# Altium project FMC_4Hyperram_board.PrjPcb
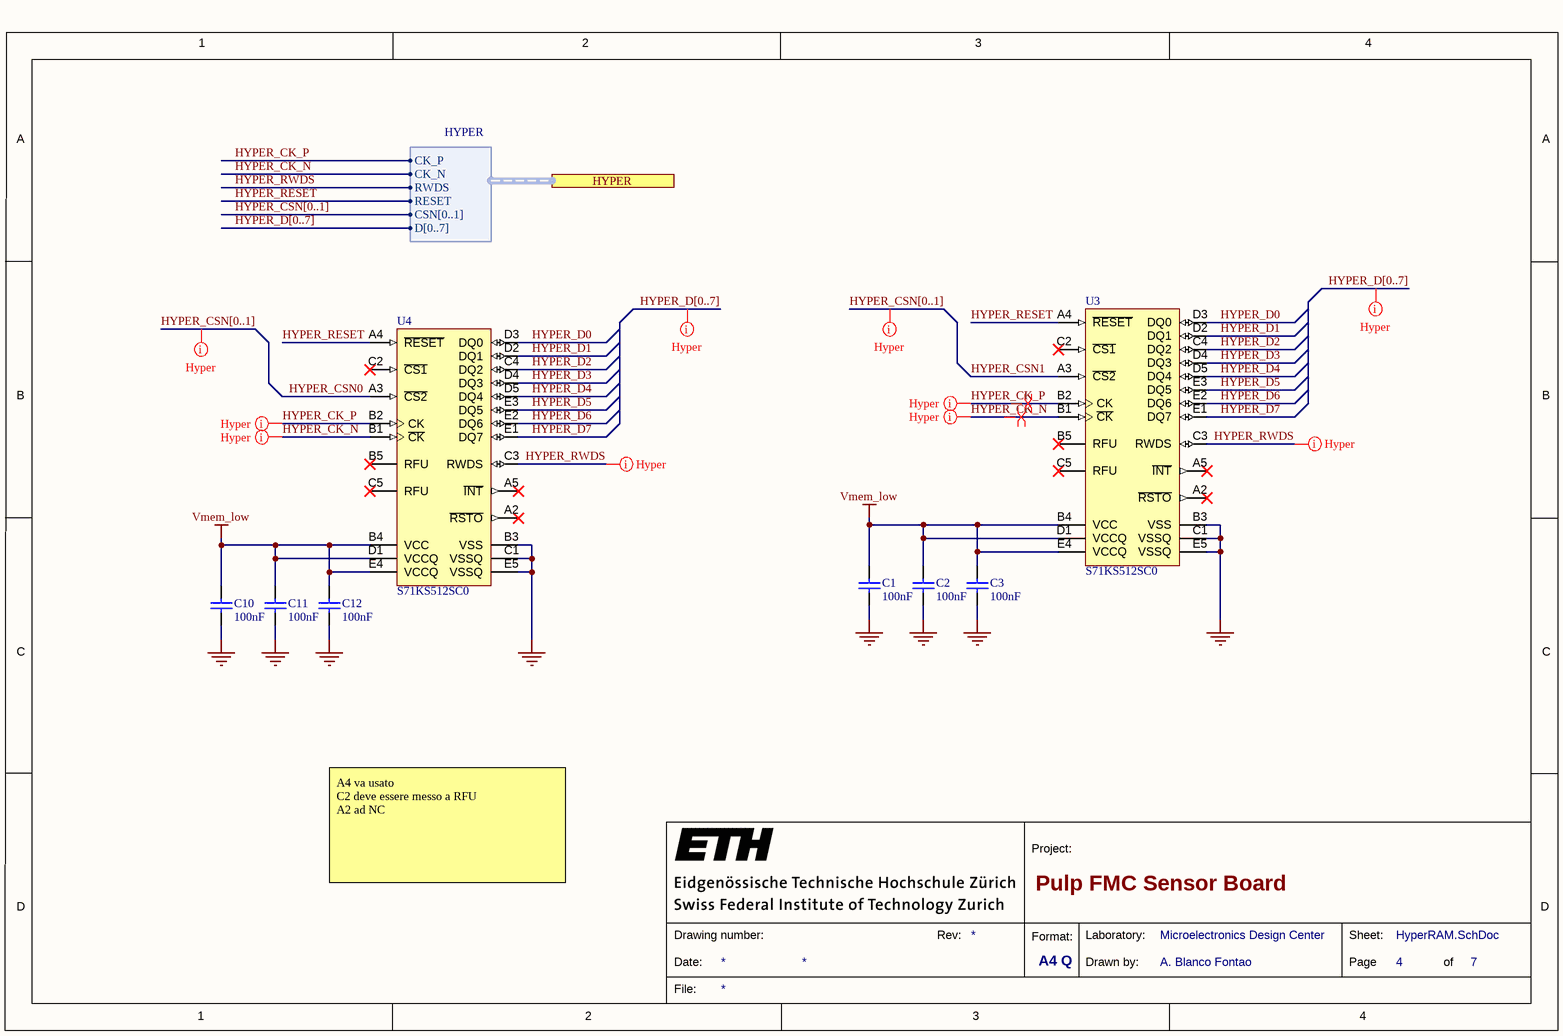
[diagram p0: HyperRAM.SchDoc]
3 sheets, 27 parts. Net scope: flat (ports and power ports of the same name join across sheets).
Board file: FMC_4Hyperram_board.PcbDoc
Sheets:
  HyperRAM.SchDoc
  HyperRAM2.SchDoc
  FMC and Power.SchDoc

## Sheet HyperRAM.SchDoc: Pulp FMC Sensor Board
size A4; Author: A. Blanco Fontao; CompanyName: ETHZ; DrawnBy: A. Blanco Fontao; Organization: Microelectronics Design Center; Address1: Gloriastrasse 35; Address2: 8092 Zurich; Address3: Switzerland; SheetNumber: 4; SheetTotal: 7

### Parts
C1  value 100nF  [CAPC0603(1608)100_N]  (hidden comment: CAP 100nF 25V 0603(1608))
C2  value 100nF  [CAPC0603(1608)100_N]  (hidden comment: CAP 100nF 25V 0603(1608))
C3  value 100nF  [CAPC0603(1608)100_N]  (hidden comment: CAP 100nF 25V 0603(1608))
C10  value 100nF  [CAPC0603(1608)100_N]  (hidden comment: CAP 100nF 25V 0603(1608))
C11  value 100nF  [CAPC0603(1608)100_N]  (hidden comment: CAP 100nF 25V 0603(1608))
C12  value 100nF  [CAPC0603(1608)100_N]  (hidden comment: CAP 100nF 25V 0603(1608))
U3  S71KS512SC0  [FBGA24_A-130]
U4  S71KS512SC0  [FBGA24_A-130]

### Ports
HYPER (harness HYPER)

### Harnesses
HYPER: CK_N, CK_P, RWDS, CSN[0..1], D[0..7], RESET

### Nets
GND: C1.1 C2.1 C3.1 C10.1 C11.1 C12.1 U3.B3(VSS) U3.C1(VSSQ) U3.E5(VSSQ) U4.B3(VSS) U4.C1(VSSQ) U4.E5(VSSQ)
Vmem_low: C1.2 C2.2 C3.2 C10.2 C11.2 C12.2 U3.B4(VCC) U3.D1(VCCQ) U3.E4(VCCQ) U4.B4(VCC) U4.D1(VCCQ) U4.E4(VCCQ)
HYPER_CK_N: U3.B1(~{CK}) U4.B1(~{CK}) ; port HYPER.CK_N
HYPER_CK_P: U3.B2(CK) U4.B2(CK) ; port HYPER.CK_P
HYPER_CSN0: U4.A3(~{CS2})
HYPER_CSN1: U3.A3(~{CS2})
HYPER_D0: U3.D3(DQ0) U4.D3(DQ0)
HYPER_D1: U3.D2(DQ1) U4.D2(DQ1)
HYPER_D2: U3.C4(DQ2) U4.C4(DQ2)
HYPER_D3: U3.D4(DQ3) U4.D4(DQ3)
HYPER_D4: U3.D5(DQ4) U4.D5(DQ4)
HYPER_D5: U3.E3(DQ5) U4.E3(DQ5)
HYPER_D6: U3.E2(DQ6) U4.E2(DQ6)
HYPER_D7: U3.E1(DQ7) U4.E1(DQ7)
HYPER_RESET: U3.A4(~{RESET}) U4.A4(~{RESET}) ; port HYPER.RESET
HYPER_RWDS: U3.C3(RWDS) U4.C3(RWDS) ; port HYPER.RWDS

Not connected (* = marked no-connect by the designer): U3 A2(~{RSTO})* A5(~{INT})* B5(RFU)* C2(~{CS1})* C5(RFU)*; U4 A2(~{RSTO})* A5(~{INT})* B5(RFU)* C2(~{CS1})* C5(RFU)*

### Buses and harness runs
bus HYPER_CSN[0..1]
bus HYPER_D[0..7]

### Layout directives
net class Hyper: (no net found under the mark), HYPER_CK_N, HYPER_CK_P, HYPER_RWDS
differential pair: HYPER_CK_N, HYPER_CK_P

### Notes on the sheet
- A4 va usato
  C2 deve essere messo a RFU
  A2 ad NC
- 1
- 2
- 3
- 4
- A
- B
- C
- Project:
- D
- Date:
- Drawing number:
- Rev:
- Format:
- A4 Q
- Drawn by:
- Laboratory:
- Page
- Sheet:
- of
- File:

### Library data of the parts
C1-C3 C10-C12 = CMP-1035-02588-1: CAP 100nF 25V ±10% 0603 (1608 Metric) Thickness 1mm SMD; Case-Metric: 1608; Case-EIA: 0603; Tolerance: Â±10%; Max Thickness: 1 mm; Technology: SMT; Rated Voltage: 25 V
U3 U4 = CMP-00514-1: IC 512MB FLASH 64MB DRAM 24FBGA; Manufacturer: Cypress Semiconductor Corp; Memory Format: FLASH, RAM; Memory Type: Non-Volatile; Memory Size: 512Mbit Flash, 64Mbit RAM; Speed: 100MHz; Interface: Parallel, Serial; Voltage - Supply: 1.8V; Series: HyperFlash™ + HyperRAM™ KS; Package / Case: 24-VBGA; Supplier Device Package: 24-FBGA(6x8)

## Sheet HyperRAM2.SchDoc: Pulp FMC Sensor Board
size A4; Author: A. Blanco Fontao; CompanyName: ETHZ; DrawnBy: A. Blanco Fontao; Organization: Microelectronics Design Center; Address1: Gloriastrasse 35; Address2: 8092 Zurich; Address3: Switzerland; SheetNumber: 5; SheetTotal: 7
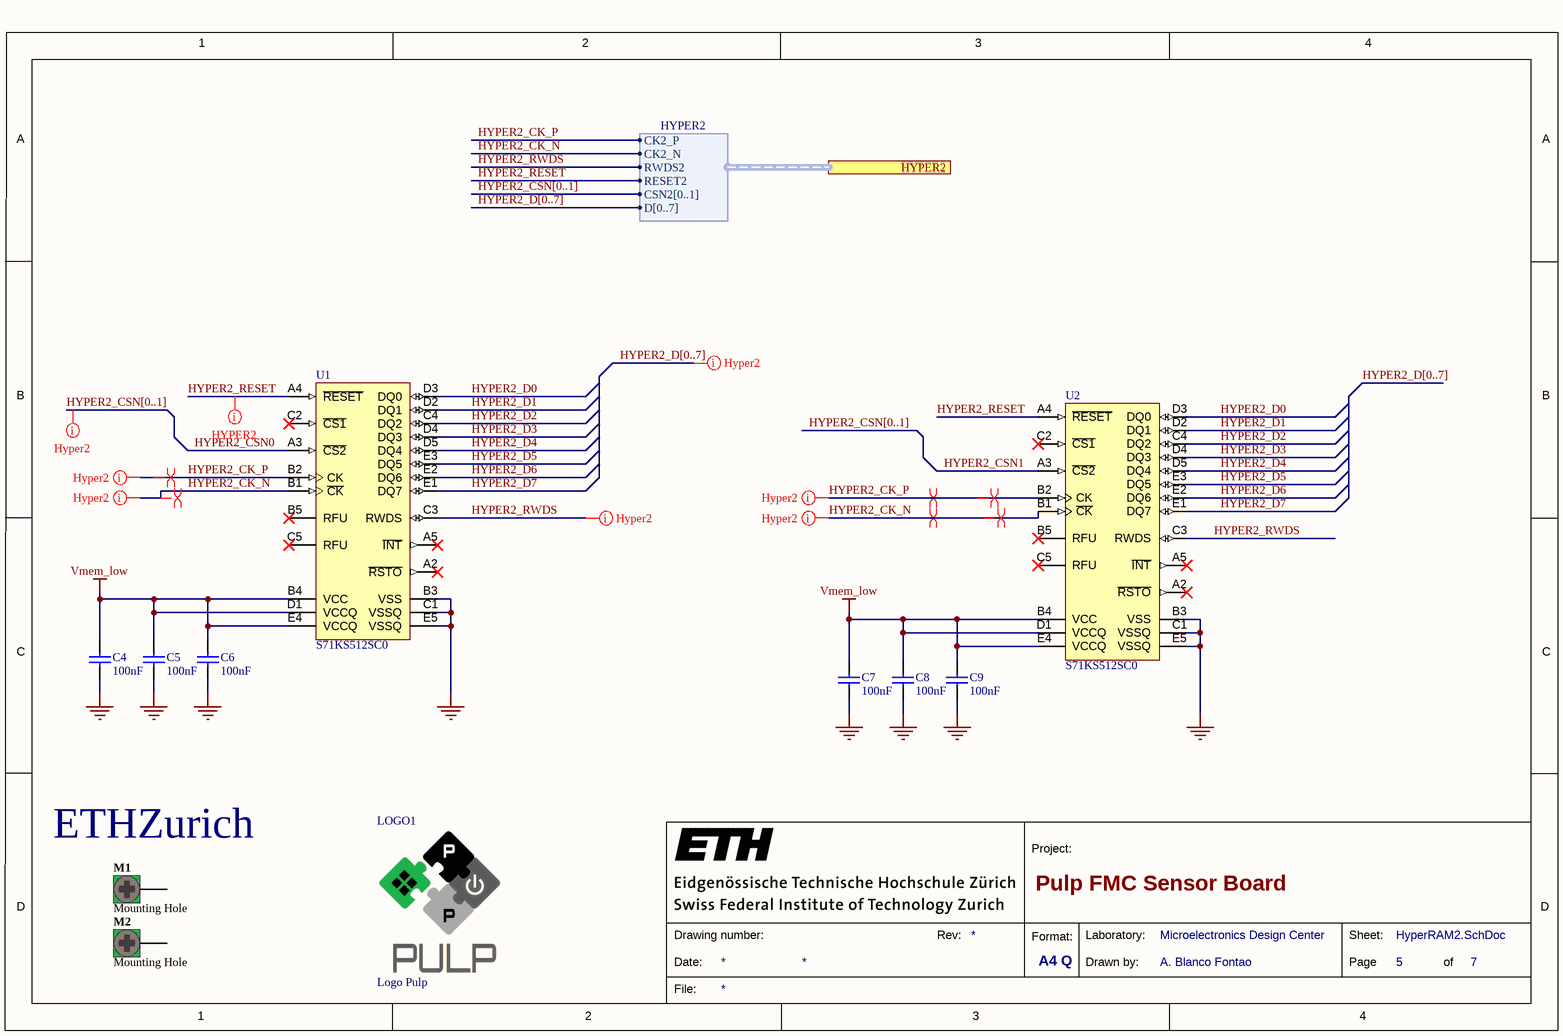
[diagram p1: HyperRAM2.SchDoc]

### Parts
A1  Logo ETH Zurich  [eth-zurich_3mm]  (value not drawn)  (no BOM)
C4  value 100nF  [CAPC0603(1608)100_N]  (hidden comment: CAP 100nF 25V 0603(1608))
C5  value 100nF  [CAPC0603(1608)100_N]  (hidden comment: CAP 100nF 25V 0603(1608))
C6  value 100nF  [CAPC0603(1608)100_N]  (hidden comment: CAP 100nF 25V 0603(1608))
C7  value 100nF  [CAPC0603(1608)100_N]  (hidden comment: CAP 100nF 25V 0603(1608))
C8  value 100nF  [CAPC0603(1608)100_N]  (hidden comment: CAP 100nF 25V 0603(1608))
C9  value 100nF  [CAPC0603(1608)100_N]  (hidden comment: CAP 100nF 25V 0603(1608))
LOGO1  Logo Pulp  [Logo Pulp]  (no BOM)
M1  Mounting Hole  [Hole M3]  (no BOM)
M2  Mounting Hole  [Hole M3]  (no BOM)
U1  S71KS512SC0  [FBGA24_A-130]
U2  S71KS512SC0  [FBGA24_A-130]

### Ports
HYPER2 (harness HYPER2)

### Harnesses
HYPER2: D[0..7], CK2_P, CK2_N, RWDS2, CSN2[0..1], RESET2

### Nets
GND: C4.1 C5.1 C6.1 C7.1 C8.1 C9.1 U1.B3(VSS) U1.C1(VSSQ) U1.E5(VSSQ) U2.B3(VSS) U2.C1(VSSQ) U2.E5(VSSQ)
Vmem_low: C4.2 C5.2 C6.2 C7.2 C8.2 C9.2 U1.B4(VCC) U1.D1(VCCQ) U1.E4(VCCQ) U2.B4(VCC) U2.D1(VCCQ) U2.E4(VCCQ)
HYPER2_CK_N: U1.B1(~{CK}) U2.B1(~{CK}) ; port HYPER2.CK2_N
HYPER2_CK_P: U1.B2(CK) U2.B2(CK) ; port HYPER2.CK2_P
HYPER2_CSN0: U1.A3(~{CS2})
HYPER2_CSN1: U2.A3(~{CS2})
HYPER2_D0: U1.D3(DQ0) U2.D3(DQ0)
HYPER2_D1: U1.D2(DQ1) U2.D2(DQ1)
HYPER2_D2: U1.C4(DQ2) U2.C4(DQ2)
HYPER2_D3: U1.D4(DQ3) U2.D4(DQ3)
HYPER2_D4: U1.D5(DQ4) U2.D5(DQ4)
HYPER2_D5: U1.E3(DQ5) U2.E3(DQ5)
HYPER2_D6: U1.E2(DQ6) U2.E2(DQ6)
HYPER2_D7: U1.E1(DQ7) U2.E1(DQ7)
HYPER2_RESET: U1.A4(~{RESET}) U2.A4(~{RESET}) ; port HYPER2.RESET2
HYPER2_RWDS: U1.C3(RWDS) U2.C3(RWDS) ; port HYPER2.RWDS2

Not connected (* = marked no-connect by the designer): M1 1; M2 1; U1 A2(~{RSTO})* A5(~{INT})* B5(RFU)* C2(~{CS1})* C5(RFU)*; U2 A2(~{RSTO})* A5(~{INT})* B5(RFU)* C2(~{CS1})* C5(RFU)*

### Buses and harness runs
bus HYPER2_CSN[0..1]
bus HYPER2_D[0..7]

### Layout directives
differential pair: HYPER2_CK_N, HYPER2_CK_P
mark named HYPER2: HYPER2_RESET
net class Hyper2: (no net found under the mark), HYPER2_CK_N, HYPER2_CK_P, HYPER2_RWDS

### Notes on the sheet
- 1
- 2
- 3
- 4
- A
- B
- C
- Project:
- D
- Date:
- Drawing number:
- Rev:
- Format:
- A4 Q
- Drawn by:
- Laboratory:
- Page
- Sheet:
- of
- File:
- (in symbol CMP-00038-1) ETHZurich

### Library data of the parts
A1 = CMP-00038-1
C4-C9 = CMP-1035-02588-1: as C1 on sheet HyperRAM; Max Thickness: 1 mm; Technology: SMT; Rated Voltage: 25 V
LOGO1 = CMP-00145-1: 4 Layers: only valid for layer stack as defined for the TestBoards
M1 M2 = CMP-00023-1: Mounting Hole, 7.2mm pad, 3.2mm plated hole; ClassName: Mounting Hole
U1 U2 = CMP-00514-1: as U3 on sheet HyperRAM; Series: HyperFlash™ + HyperRAM™ KS; Package / Case: 24-VBGA; Supplier Device Package: 24-FBGA(6x8)

## Sheet FMC and Power.SchDoc: Pulp FMC Sensor Board
size A3; Author: A. Blanco Fontao; CompanyName: ETHZ; DrawnBy: A. Blanco Fontao; Organization: Microelectronics Design Center; Address1: Gloriastrasse 35; Address2: 8092 Zurich; Address3: Switzerland; SheetNumber: 2; SheetTotal: 7
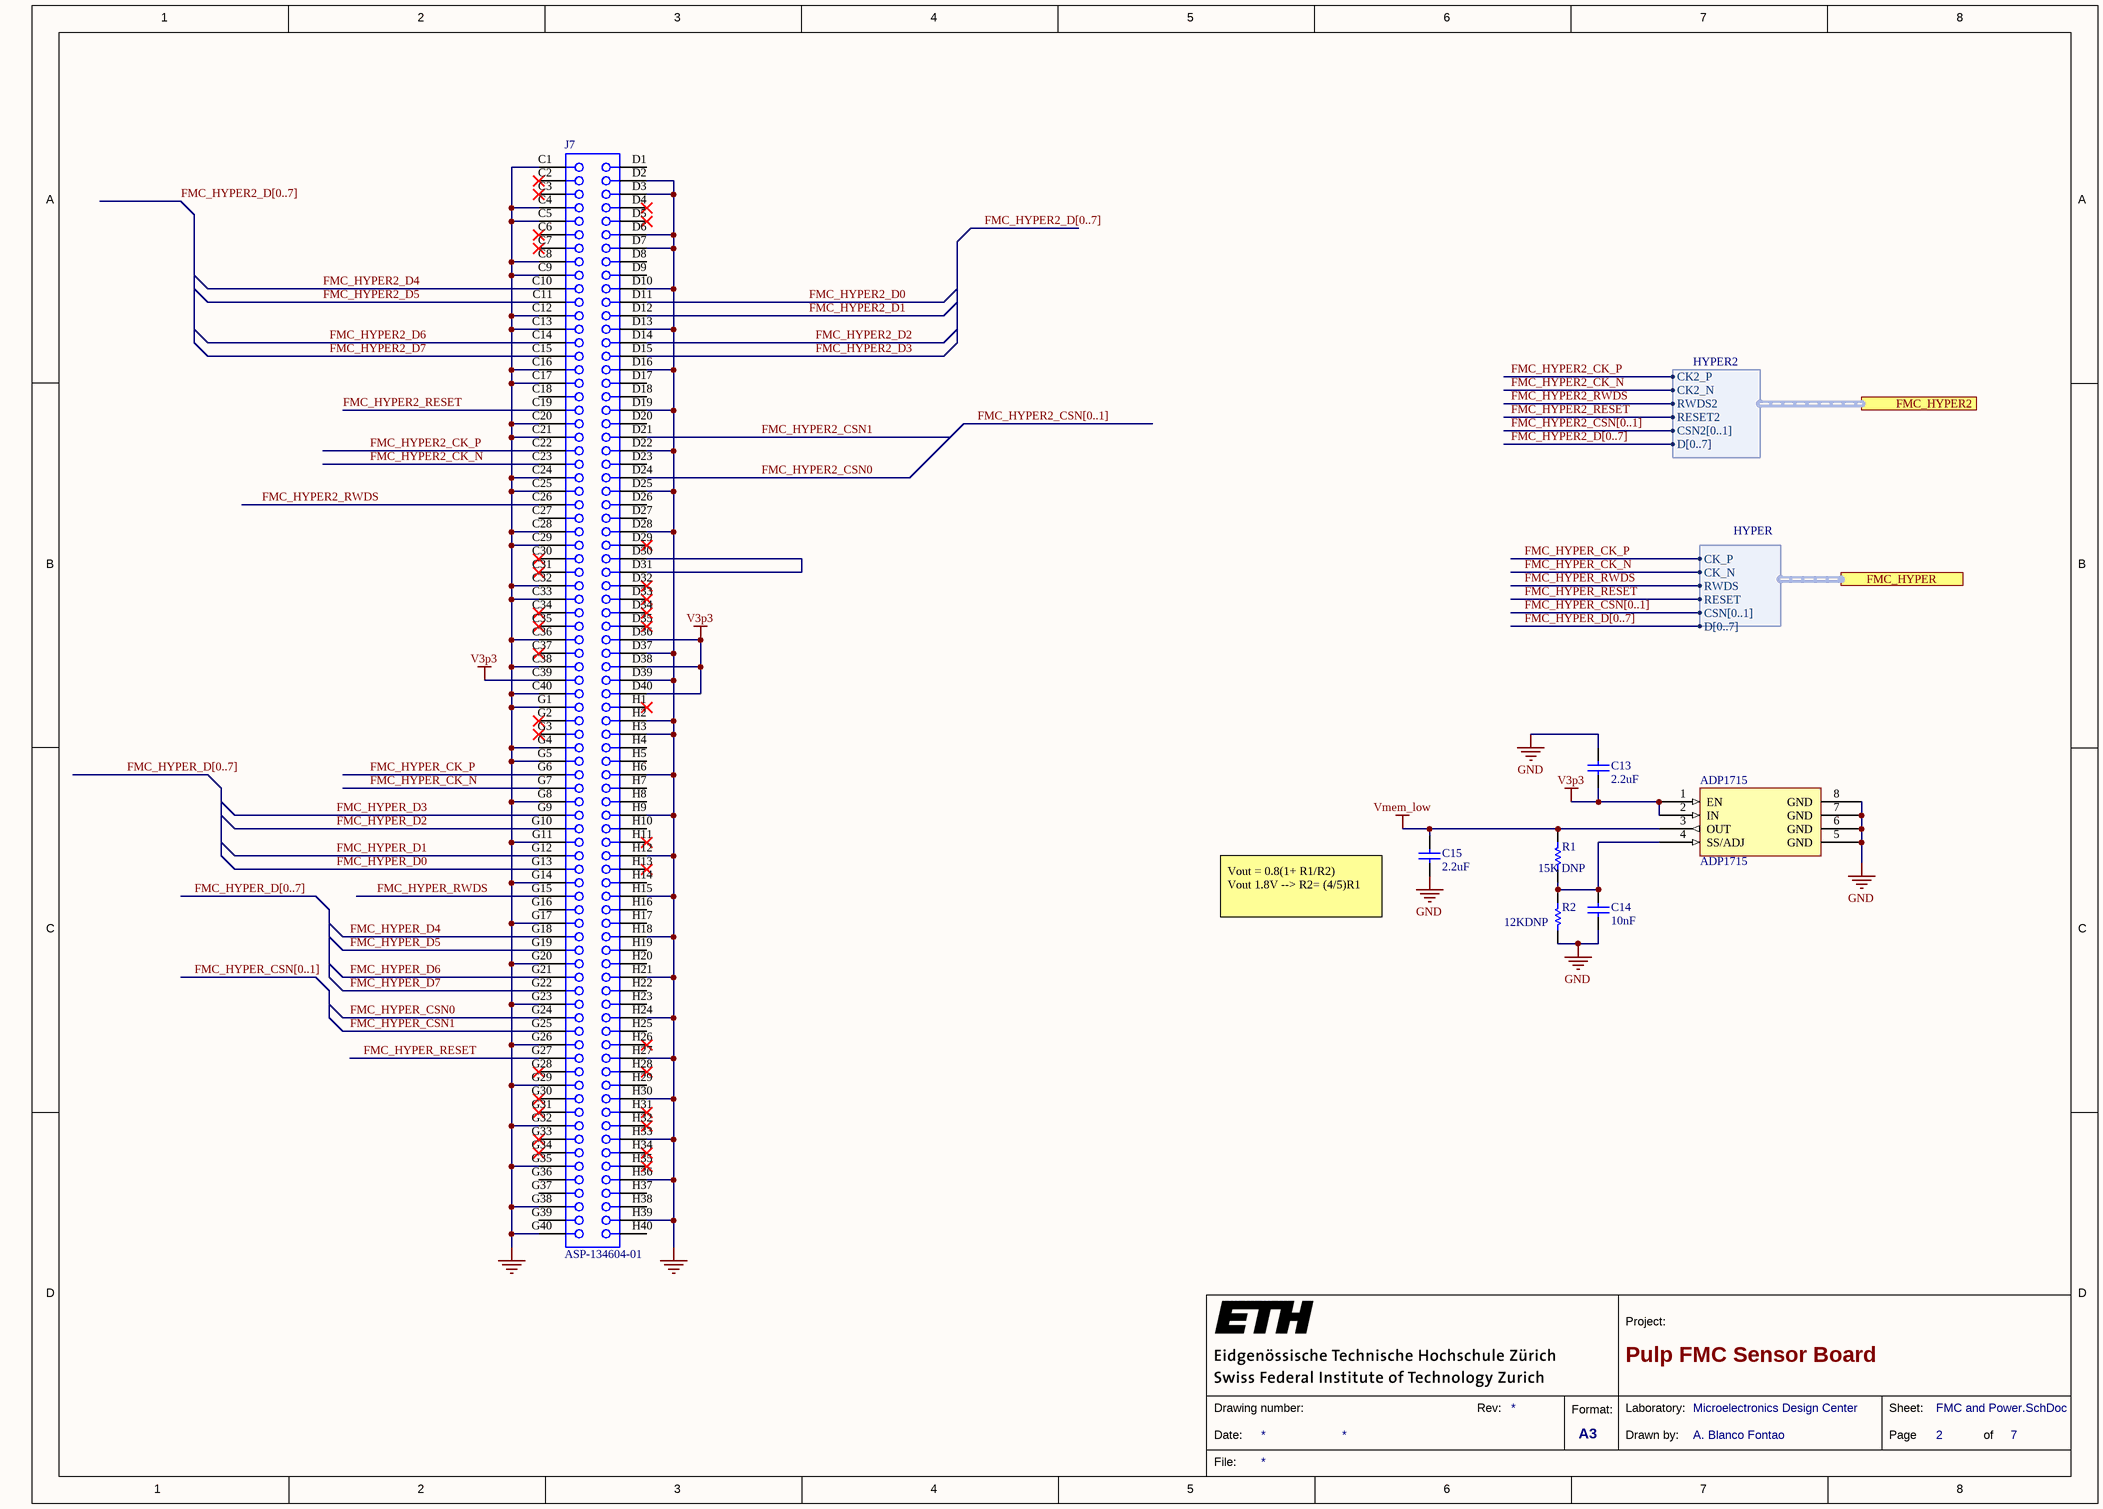
[diagram p2: FMC and Power.SchDoc]

### Parts
ADP1715  ADP1715  [TSOP65P490X110-8N]
C13  value 2.2uF  [CAPC0603(1608)100_N]  (hidden comment: CAP 100nF 25V 0603(1608))
C14  value 10nF  [CAPC0603(1608)100_N]  (hidden comment: CAP 100nF 25V 0603(1608))
C15  value 2.2uF  [CAPC0603(1608)100_N]  (hidden comment: CAP 100nF 25V 0603(1608))
J7  ASP-134604-01  [ASP-134604-01]
R1  value 15K DNP  [RESC0603(1608)_N]  (hidden comment: 15K 5% 0603(1608))
R2  value 12KDNP  [RESC0603(1608)_N]  (hidden comment: 12K 5% 0603(1608))

### Ports
FMC_HYPER2 (harness HYPER2), FMC_HYPER (harness HYPER)

### Harnesses
HYPER2: D[0..7], CK2_P, CK2_N, RWDS2, CSN2[0..1], RESET2
HYPER: CK_N, CK_P, RWDS, CSN[0..1], D[0..7], RESET

### Nets
GND: ADP1715.5(GND) ADP1715.6(GND) ADP1715.7(GND) ADP1715.8(GND) C13.2 C14.1 C15.1 J7.C1 J7.C4 J7.C5 J7.C8 J7.C9 J7.C12 J7.C13 J7.C16 J7.C17 J7.C20 J7.C21 J7.C24 J7.C25 J7.C28 J7.C29 J7.C32 J7.C33 J7.C36 J7.C38 J7.C40 J7.D2 J7.D3 J7.D6 J7.D7 J7.D10 J7.D13 J7.D16 J7.D19 J7.D22 J7.D25 J7.D28 J7.D37 J7.D39 J7.G1 J7.G4 J7.G5 J7.G8 J7.G11 J7.G14 J7.G17 J7.G20 J7.G23 J7.G26 J7.G29 J7.G32 J7.G35 J7.G38 J7.G40 J7.H2 J7.H3 J7.H6 J7.H9 J7.H12 J7.H15 J7.H18 J7.H21 J7.H24 J7.H27 J7.H30 J7.H33 J7.H36 J7.H39 R2.1
V3p3: ADP1715.1(EN) ADP1715.2(IN) C13.1 J7.C39 J7.D36 J7.D38 J7.D40
Vmem_low: ADP1715.3(OUT) C15.2 R1.2
FMC_HYPER2_CK_N: J7.C23 ; port FMC_HYPER2.CK2_N
FMC_HYPER2_CK_P: J7.C22 ; port FMC_HYPER2.CK2_P
FMC_HYPER2_CSN0: J7.D24
FMC_HYPER2_CSN1: J7.D21
FMC_HYPER2_D0: J7.D11
FMC_HYPER2_D1: J7.D12
FMC_HYPER2_D2: J7.D14
FMC_HYPER2_D3: J7.D15
FMC_HYPER2_D4: J7.C10
FMC_HYPER2_D5: J7.C11
FMC_HYPER2_D6: J7.C14
FMC_HYPER2_D7: J7.C15
FMC_HYPER2_RESET: J7.C19 ; port FMC_HYPER2.RESET2
FMC_HYPER2_RWDS: J7.C26 ; port FMC_HYPER2.RWDS2
FMC_HYPER_CK_N: J7.G7 ; port FMC_HYPER.CK_N
FMC_HYPER_CK_P: J7.G6 ; port FMC_HYPER.CK_P
FMC_HYPER_CSN0: J7.G24
FMC_HYPER_CSN1: J7.G25
FMC_HYPER_D0: J7.G13
FMC_HYPER_D1: J7.G12
FMC_HYPER_D2: J7.G10
FMC_HYPER_D3: J7.G9
FMC_HYPER_D4: J7.G18
FMC_HYPER_D5: J7.G19
FMC_HYPER_D6: J7.G21
FMC_HYPER_D7: J7.G22
FMC_HYPER_RESET: J7.G27 ; port FMC_HYPER.RESET
FMC_HYPER_RWDS: J7.G15 ; port FMC_HYPER.RWDS
NetADP1715_4: ADP1715.4(SS/ADJ) C14.2 R1.1 R2.2
NetJ7_D30: J7.D30 J7.D31

Not connected (* = marked no-connect by the designer): J7 C2* C3* C6* C7* C18 C27 C30* C31* C34* C35* C37* D1 D4* D5* D8 D9 D17 D18 D20 D23 D26 D27 D29* D32* D33* D34* D35* G2* G3* G16 G28* G30* G31* G33* G34* G36 G37 G39 H1* H4 H5 H7 H8 H10 H11* H13* H14 H16 H17 H19 H20 H22 H23 H25 H26* H28* H29 H31* H32* H34* H35* H37 H38 H40

### Buses and harness runs
bus FMC_HYPER2_CSN[0..1]
bus FMC_HYPER2_D[0..7]
bus FMC_HYPER_CSN[0..1]
bus FMC_HYPER_D[0..7]

### Notes on the sheet
- (near C15) Vout = 0.8(1+ R1/R2)
  Vout 1.8V --> R2= (4/5)R1
- 1
- 2
- 3
- 4
- 5
- 6
- 7
- 8
- A
- B
- C
- D
- Project:
- Date:
- Drawing number:
- Rev:
- Format:
- A3
- Drawn by:
- Laboratory:
- Page
- Sheet:
- of
- File:

### Library data of the parts
C13-C15 = CMP-1035-02588-1: as C1 on sheet HyperRAM; Max Thickness: 1 mm; Technology: SMT; Rated Voltage: 25 V
J7 = CMP-00488-1: Conn Array Terminal FMC Male SKT 160 POS 1.27mm Solder ST SMD; Manufacturer: Samtec; Number of arrays: 4; Number of poles: 160; Pitch: 1.27mm; Product type: SKT; Width: 14.68mm; Wire connection method: Solder; Length: 55.78mm; Manufacturer Part Number: ASP-134604-01; Supplier: Digikey; Supplier Part Number: SAM8732-ND; ComponentLink1Description: asp-134604-01-9532665.pdf; ComponentLink1URL: https://datasheet.ciiva.com/9532/asp-134604-01-9532665.pdf; ComponentLink2Description: asp-134604-01-403751.pdf; ComponentLink2URL: https://datasheet.ciiva.com/403/asp-134604-01-403751.pdf
R1 = CMP-1012-00098-1: 15K 0.1W 5% 0603 (1608 Metric)  SMD; Case-EIA: 0603; Case-Metric: 1608; Technology: SMT; Tolerance: 5 %; Power: 0.1 W
R2 = CMP-1012-00098-1: 12K 0.1W 5% 0603 (1608 Metric)  SMD; Case-EIA: 0603; Case-Metric: 1608; Technology: SMT; Tolerance: 5 %; Power: 0.1 W

## Nets that join several sheets
GND: HyperRAM (12 pins), HyperRAM2 (12 pins), FMC and Power (70 pins)
Vmem_low: HyperRAM (12 pins), HyperRAM2 (12 pins), FMC and Power (ADP1715.3 C15.2 R1.2)